# Altium project Servo-Board-v1.0.PrjPcb (part 15 of 19)

## Sheet DIO_3.SchDoc
size 420 x 297 mm; SheetNumber: 26; SheetTotal: 32
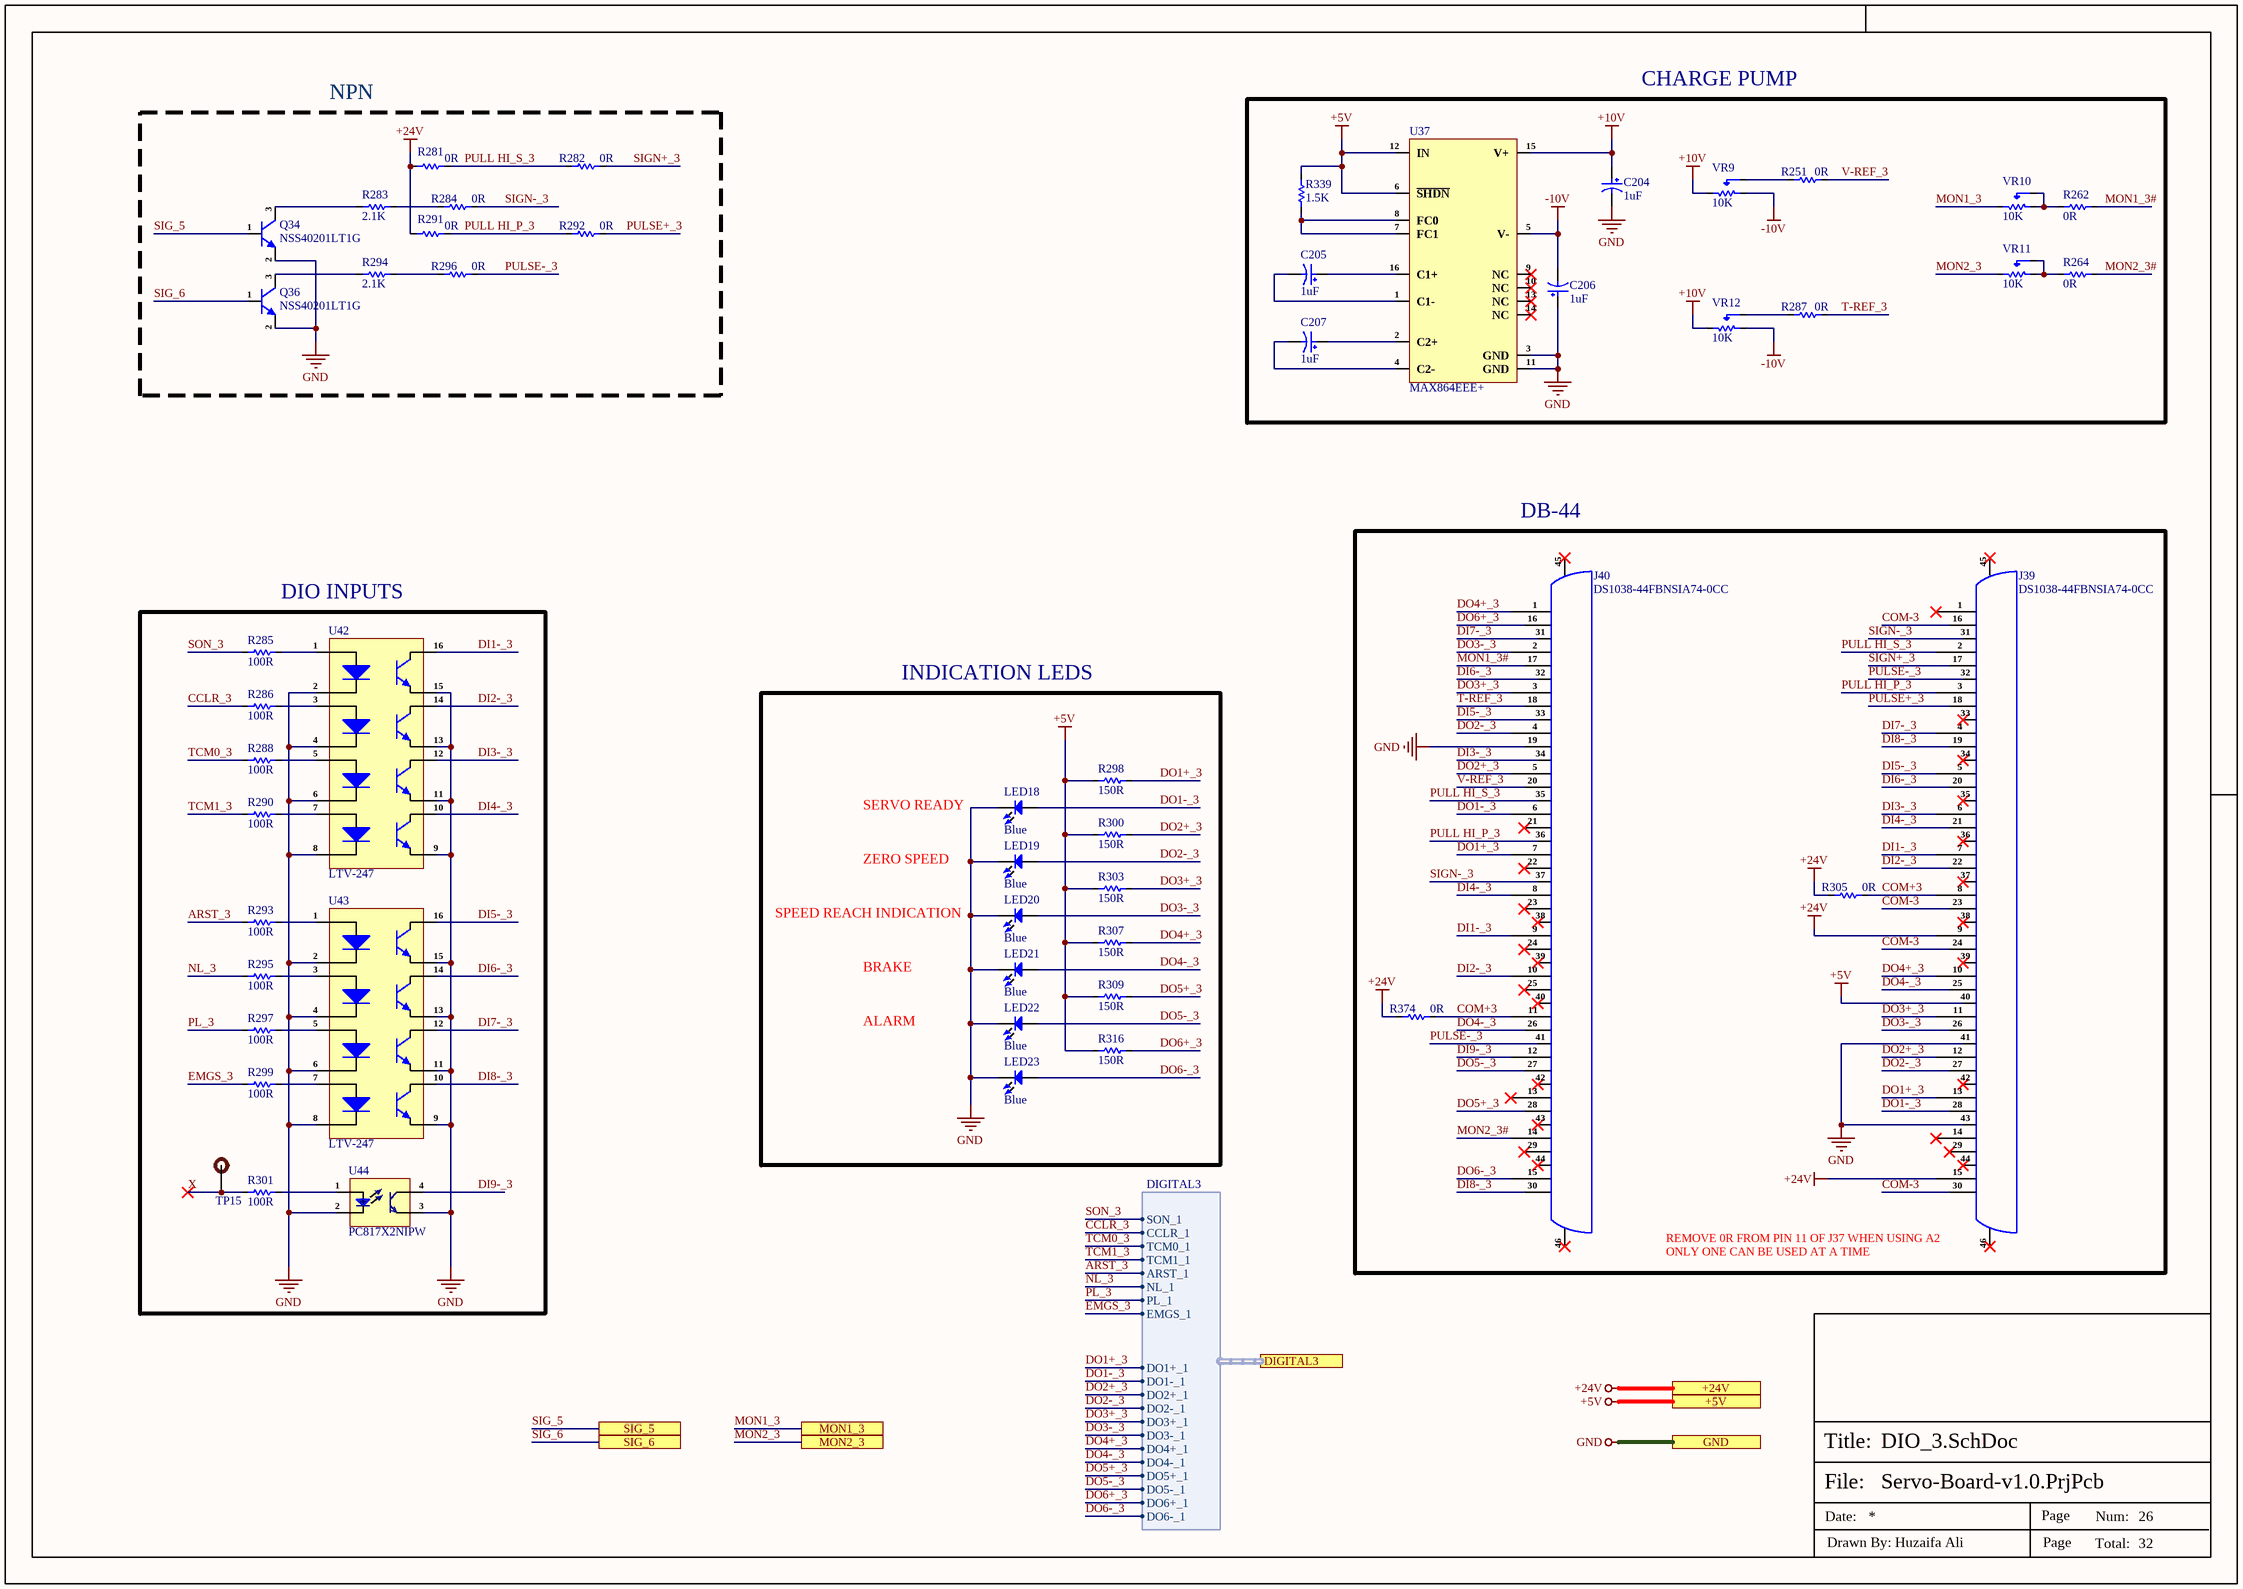
[diagram p25: DIO_3.SchDoc]

### Parts
C204  1uF  [RVT1H1R0M0405]
C205  1uF  [RVT1H1R0M0405]
C206  1uF  [RVT1H1R0M0405]
C207  1uF  [RVT1H1R0M0405]
J39  DS1038-44FBNSIA74-0CC  [DS1038-44FBNSIA74-0CC]
J40  DS1038-44FBNSIA74-0CC  [DS1038-44FBNSIA74-0CC]
LED18  Blue  [LED-0603]
LED19  Blue  [LED-0603]
LED20  Blue  [LED-0603]
LED21  Blue  [LED-0603]
LED22  Blue  [LED-0603]
LED23  Blue  [LED-0603]
Q34  NSS40201LT1G  [SOT-23]
Q36  NSS40201LT1G  [SOT-23]
R251  0R  [Res-0402]
R262  0R  [Res-0402]
R264  0R  [Res-0402]
R281  0R  [Res-0603]
R282  0R  [Res-0603]
R283  2.1K  [Res-0603]
R284  0R  [Res-0603]
R285  100R  [Res-0402]
R286  100R  [Res-0402]
R287  0R  [Res-0402]
R288  100R  [Res-0402]
R290  100R  [Res-0402]
R291  0R  [Res-0603]
R292  0R  [Res-0603]
R293  100R  [Res-0402]
R294  2.1K  [Res-0603]
R295  100R  [Res-0402]
R296  0R  [Res-0603]
R297  100R  [Res-0402]
R298  150R  [Res-0603]
R299  100R  [Res-0402]
R300  150R  [Res-0603]
R301  100R  [Res-0402]
R303  150R  [Res-0603]
R305  0R  [Res-0402]
R307  150R  [Res-0603]
R309  150R  [Res-0603]
R316  150R  [Res-0603]
R339  1.5K  [Res-0402]
R374  0R  [Res-0402]
TP15  TEST POINT  [Test-point]  (value not drawn)  (no BOM)
U37  MAX864EEE+  [16-QSOP]
U42  LTV-247  [16-SO]
U43  LTV-247  [16-SO]
U44  PC817X2NIPW  [PC817X2NIPW]
VR9  10K  [3362P-1-103]
VR10  10K  [3362P-1-103]
VR11  10K  [3362P-1-103]
VR12  10K  [3362P-1-103]

### Blocks framed on the sheet
NPN: Q34 Q36 R281-R284 R291 R292 R294 R296

### Ports
+5V (see Servo3[4C], CAN_Sheet[5D], DIO_1[5D], DIO_2[5D], DIO_4[5D], Encoder_Sheet1[5D], Encoder_Sheet2[5D], Encoder_Sheet3[5D], Encoder_Sheet4[5D], Power_Sheet[5D]), +24V (see Servo3[4C], Connector_Sheet[5D], DIO_1[5D], DIO_2[5D], DIO_4[5D], MOSFET_Driver_Sheet1[5D], MOSFET_Driver_Sheet2[5D], MOSFET_Driver_Sheet3[5D], MOSFET_Driver_Sheet4[5D], Motor_Driver_Sheet1[5D], Motor_Driver_Sheet2[5D], Motor_Driver_Sheet3[5D], Motor_Driver_Sheet4[5D], Power_Sheet[5D]), DIGITAL3 (harness DIGITAL3, see Servo3[4C], Sec_Controller_Sheet3[4D]), GND (see Servo3[4C], CAN_Sheet[5D], Connector_Sheet[5D], Controller_Sheet[5D], DIO_1[5D], DIO_2[5D], DIO_4[5D], Encoder_Sheet1[5D], Encoder_Sheet2[5D], Encoder_Sheet3[5D], Encoder_Sheet4[5D], EtherCAT_Sheet[5D], MOSFET_Driver_Sheet1[5D], MOSFET_Driver_Sheet2[5D], MOSFET_Driver_Sheet3[5D], MOSFET_Driver_Sheet4[5D], Motor_Driver_Sheet1[5D], Motor_Driver_Sheet2[5D], Motor_Driver_Sheet3[5D], Motor_Driver_Sheet4[5D], Power_Sheet[5D], RJ45_Sheet[5D], RS485_RS232_Sheet[3D], Sec_Controller_Sheet1[5D], Sec_Controller_Sheet2[5D], Sec_Controller_Sheet3[5D], Sec_Controller_Sheet4[5D]), MON1_3 (see Servo3[4C], Sec_Controller_Sheet3[3D]), MON2_3 (see Servo3[4C], Sec_Controller_Sheet3[3D]), SIG_5 (see Servo3[4C], Sec_Controller_Sheet3[3D]), SIG_6 (see Servo3[4C], Sec_Controller_Sheet3[3D])

### Harnesses
DIGITAL3: SON_1, TCM0_1, CCLR_1, TCM1_1, ARST_1, NL_1, PL_1, EMGS_1, DO1+_1, DO1-_1, DO2+_1, DO2-_1, DO3+_1, DO3-_1, DO4+_1, DO4-_1, DO5+_1, DO5-_1, DO6+_1, DO6-_1

### Nets
+5V: J39.40 R298.1 R300.1 R303.1 R307.1 R309.1 R316.1 R339.2 U37.6(~{SHDN}) U37.12(IN) ; port +5V
+10V: C204.1 U37.15(V+) VR9.3(CW) VR12.3(CW)
+24V: J39.9 J39.15 R281.1 R291.1 R305.1 R374.1 ; port +24V  [project net VDRAIN]
-10V: C206.2 U37.5(V-) VR9.1(CCW) VR12.1(CCW)
GND: C204.2 C206.1 J39.41 J39.43 J40.19 LED18.2 LED19.2 LED20.2 LED21.2 LED22.2 LED23.2 Q34.2(E) Q36.2(E) U37.3(GND) U37.11(GND) U42.2(K) U42.4(K) U42.6(K) U42.8(K) U42.9(E) U42.11(E) U42.13(E) U42.15(E) U43.2(K) U43.4(K) U43.6(K) U43.8(K) U43.9(E) U43.11(E) U43.13(E) U43.15(E) U44.2(Ca) U44.3(E) ; port GND
ARST_3: R293.1 ; port DIGITAL3.ARST_1
CCLR_3: R286.1 ; port DIGITAL3.CCLR_1
COM+3: J39.8 J40.11 R305.2 R374.2
COM-3: J39.16 J39.23 J39.24 J39.30
DI1-_3: J39.7 J40.9 U42.16(C)
DI2-_3: J39.22 J40.10 U42.14(C)
DI3-_3: J39.6 J40.34 U42.12(C)
DI4-_3: J39.21 J40.8 U42.10(C)
DI5-_3: J39.5 J40.33 U43.16(C)
DI6-_3: J39.20 J40.32 U43.14(C)
DI7-_3: J39.4 J40.31 U43.12(C)
DI8-_3: J39.19 J40.30 U43.10(C)
DI9-_3: J40.12 U44.4(C)
DO1+_3: J39.13 J40.7 R298.2 ; port DIGITAL3.DO1+_1
DO1-_3: J39.28 J40.6 LED18.1 ; port DIGITAL3.DO1-_1
DO2+_3: J39.12 J40.5 R300.2 ; port DIGITAL3.DO2+_1
DO2-_3: J39.27 J40.4 LED19.1 ; port DIGITAL3.DO2-_1
DO3+_3: J39.11 J40.3 R303.2 ; port DIGITAL3.DO3+_1
DO3-_3: J39.26 J40.2 LED20.1 ; port DIGITAL3.DO3-_1
DO4+_3: J39.10 J40.1 R307.2 ; port DIGITAL3.DO4+_1
DO4-_3: J39.25 J40.26 LED21.1 ; port DIGITAL3.DO4-_1
DO5+_3: J40.28 R309.2 ; port DIGITAL3.DO5+_1
DO5-_3: J40.27 LED22.1 ; port DIGITAL3.DO5-_1
DO6+_3: J40.16 R316.2 ; port DIGITAL3.DO6+_1
DO6-_3: J40.15 LED23.1 ; port DIGITAL3.DO6-_1
EMGS_3: R299.1 ; port DIGITAL3.EMGS_1
MON1_3: VR10.3(CW) ; port MON1_3
MON1_3#: J40.17 R262.2
MON2_3: VR11.3(CW) ; port MON2_3
MON2_3#: J40.14 R264.2
NL_3: R295.1 ; port DIGITAL3.NL_1
PL_3: R297.1 ; port DIGITAL3.PL_1
PULL HI_P_3: J39.3 J40.36 R291.2 R292.1
PULL HI_S_3: J39.2 J40.35 R281.2 R282.1
PULSE+_3: J39.18 R292.2
PULSE-_3: J39.32 J40.41 R296.2
SIG_5: Q34.1(B) ; port SIG_5
SIG_6: Q36.1(B) ; port SIG_6
SIGN+_3: J39.17 R282.2
SIGN-_3: J39.31 J40.37 R284.2
SON_3: R285.1 ; port DIGITAL3.SON_1
T-REF_3: J40.18 R287.2
TCM0_3: R288.1 ; port DIGITAL3.TCM0_1
TCM1_3: R290.1 ; port DIGITAL3.TCM1_1
V-REF_3: J40.20 R251.2
X: R301.1 TP15.1
NetC205_1: C205.1 U37.16(C1+)
NetC205_2: C205.2 U37.1(C1-)
NetC207_1: C207.1 U37.2(C2+)
NetC207_2: C207.2 U37.4(C2-)
NetQ34_3: Q34.3(C) R283.1
NetQ36_3: Q36.3(C) R294.1
NetR251_1: R251.1 VR9.2(Wiper)
NetR262_1: R262.1 VR10.1(CCW) VR10.2(Wiper)
NetR264_1: R264.1 VR11.1(CCW) VR11.2(Wiper)
NetR283_2: R283.2 R284.1
NetR285_2: R285.2 U42.1(A)
NetR286_2: R286.2 U42.3(A)
NetR287_1: R287.1 VR12.2(Wiper)
NetR288_2: R288.2 U42.5(A)
NetR290_2: R290.2 U42.7(A)
NetR293_2: R293.2 U43.1(A)
NetR294_2: R294.2 R296.1
NetR295_2: R295.2 U43.3(A)
NetR297_2: R297.2 U43.5(A)
NetR299_2: R299.2 U43.7(A)
NetR301_2: R301.2 U44.1(An)
NetR339_1: R339.1 U37.7(FC1) U37.8(FC0)

Not connected (* = marked no-connect by the designer): J39 1* 14* 29* 33* 34* 35* 36* 37* 38* 39* 42* 44* 45* 46*; J40 13* 21* 22* 23* 24* 25* 29* 38* 39* 40* 42* 43* 44* 45* 46*; U37 9(NC)* 10(NC)* 13(NC)* 14(NC)*

### Notes on the sheet
- CHARGE PUMP
- (near J40) DB-44
- DIO INPUTS
- INDICATION LEDS
- SERVO READY
- ZERO SPEED
- SPEED REACH INDICATION
- BRAKE
- ALARM
- REMOVE 0R FROM PIN 11 OF J37 WHEN USING A2
- ONLY ONE CAN BE USED AT A TIME
- File:
- Title:
- Date:
- Page
- Num:
- Total:
- Drawn By: Huzaifa Ali

### Library data of the parts
C204-C207 = RVT1H1R0M0405: 1uF 50V 8mA@120Hz ±20% SMD,D4xL5.4mm Aluminum Electrolytic Capacitors - SMD ROHS; Manufacturer: Roqang; Supplier: LCSC; LCSC Part Number: C72491; Manufacturer Part Number: RVT1H1R0M0405; RoHS: No
J39 J40 = DS1038-44FBNSIA74-0CC: 44P Female D-Sub Right-Angle 3 1.5A -40℃~+105℃ Push-Pull D-Sub / VGA connector ROHS; Manufacturer: CONNFLY Elec; Manufacturer Part Number: DS1038-44FBNSIA74-0CC; Package: Push-Pull; LCSC Part Number: C77844; Item Type: D-Sub / VGA connector; ComponentLink1Description: LCSC; ComponentLink1URL: https://www.lcsc.com/product-detail/D-Sub-VGA-connector_CONNFLY-Elec-DS1038-44FBNSIA74-0CC_C77844.html
LED18-LED23 = NCD0603B3: blue 0603 Light Emitting Diodes (LED) ROHS; Manufacturer: Foshan NationStar Optoelectronics; Manufacturer Part Number: NCD0603B3; Package: 0603; LCSC Part Number: C158101; Item Type: LED; ComponentLink1Description: LCSC; ComponentLink1URL: https://www.lcsc.com/product-detail/Light-Emitting-Diodes-LED_Foshan-NationStar-Optoelectronics-NCD0603B3_C158101.html
Q34 Q36 = NSS40201LT1G: TRANS NPN 40V 2A SOT23-3; Manufacturer: ON Semiconductor; Max Power Dissipation: 540mW; Transition Frequency: 150MHz; hFE Min: 200; Number of Elements: 1; Emitter Base Voltage (VEBO): 6V; Collector Emitter Saturation Voltage: 115mV; Element Configuration: Single; Clock Frequency: 100MHz; Item Type: Transistor; Supplier 1: Future Electronics; Manufacturer Part Number: NSS40201LT1G; RoHS: Yes; Category: BJTs; Stock 1: 155; Pricing 1: 1=0.42000, 15=0.34000, 75=0.29500, 300=0.25500, 1500=0.21000 (USD); Case/Package: SOT-23-3; Pins: 3; Min Operating Temperature: -55°C; Max Operating Temperature: 150°C; Collector Emitter Voltage (VCEO): 40V; Packaging: Tape and Reel; Max Collector Current: 2A; Collector Emitter Breakdown Voltage: 40V; Polarity: NPN; Package Quantity: 3000; Frequency: 150MHz; Max Breakdown Voltage: 40V; Collector Base Voltage (VCBO): 40V; Power Dissipation: 540mW; Gain Bandwidth Product: 150MHz; Series: -; Collector-emitter Voltage-Max: 115mV; Length: 3.04mm; Width: 2.64mm; Height: 1.11mm; Radiation Hardening: No; Lead Free: Lead Free; Reach SVHC Compliant: Yes; Halogen Free: Halogen Free; RoHS Compliant: Yes; ComponentLink1URL: https://datasheet.ciiva.com/976/nss40201l-d-976800.pdf?src-supplier=Digi-Key; ComponentLink1Description: https://datasheet.ciiva.com/976/nss40201l-d-976800.pdf?src-supplier=Digi-Key; ComponentLink2URL: https://datasheet.ciiva.com/11204/nss40201l-d-11204882.pdf?src-supplier=Avnet; ComponentLink2Description: https://datasheet.ciiva.com/11204/nss40201l-d-11204882.pdf?src-supplier=Avnet; ComponentLink3URL: https://datasheet.ciiva.com/16291/nss40201l-d-115376-16291797.pdf?src-supplier=Mouser; ComponentLink3Description: https://datasheet.ciiva.com/16291/nss40201l-d-115376-16291797.pdf?src-supplier=Mouser; ComponentLink4URL: https://datasheet.ciiva.com/30480/0900766b8121b5a5-30480502.pdf?src-supplier=Rs; ComponentLink4Description: https://datasheet.ciiva.com/30480/0900766b8121b5a5-30480502.pdf?src-supplier=Rs; ComponentLink5URL: https://datasheet.ciiva.com/976/nss40201l-d-976801.pdf?src-supplier=Digi-Key; ComponentLink5Description: https://datasheet.ciiva.com/976/nss40201l-d-976801.pdf?src-supplier=Digi-Key; ComponentLink6URL: https://datasheet.ciiva.com/976/nss40201l-d-976802.pdf?src-supplier=Digi-Key; ComponentLink6Description: https://datasheet.ciiva.com/976/nss40201l-d-976802.pdf?src-supplier=Digi-Key; ComponentLink7URL: https://datasheet.ciiva.com/22641/nss40201l-d-22641179.pdf?src-supplier=Farnell; ComponentLink7Description: https://datasheet.ciiva.com/22641/nss40201l-d-22641179.pdf?src-supplier=Farnell; ComponentLink8URL: https://datasheet.ciiva.com/16222/nss40201l-d-16222093.pdf?src-supplier=Future+Electronics; ComponentLink8Description: https://datasheet.ciiva.com/16222/nss40201l-d-16222093.pdf?src-supplier=Future+Electronics; Supplier Part Number 1: 6030674; LCSC Part Number: C145175
R251 R262 R264 R287 R305 R374 = RC0402FR-070RL: as R60 on sheet Sec_Controller_Sheet3; Supplier 1: Mouser; Manufacturer Part Number: RC0402FR-070RL; RoHS: Yes; Stock 1: 8556842; Pricing 1: 1=0.10000, 10=0.01400, 50=0.01400, 100=0.00600, 1000=0.00300, 5000=0.00200, 10000=0.00100 (USD); Mount: Surface Mount; Case/Package: 0402; Contact Plating: Tin,Matte; Case Code (Imperial): 0402; Case Code (Metric): 1005; Size Code: 0402; Min Operating Temperature: -55°C; Max Operating Temperature: 155°C; Resistance: 0R; Resistor Type: Thick Film; Packaging: Tape and Reel; Termination: SMD/SMT; Features: Moisture Resistant; Series: RC; Number of Terminations: 2; Length: 1mm; Width: 0.5mm; Height: 0.35mm; Radiation Hardening: No; Lead Free: Lead Free; RoHS Compliant: Yes; ComponentLink1URL: https://datasheet.ciiva.com/8896/pyu-rc0402-51-rohs-l-6-8896149.pdf?src-supplier=Avnet; ComponentLink1Description: https://datasheet.ciiva.com/8896/pyu-rc0402-51-rohs-l-6-8896149.pdf?src-supplier=Avnet; ComponentLink2URL: https://datasheet.ciiva.com/16790/pyu-rc0402-51-rohs-l-6-r-16790444.pdf?src-supplier=Future+Electronics; ComponentLink2Description: https://datasheet.ciiva.com/16790/pyu-rc0402-51-rohs-l-6-r-16790444.pdf?src-supplier=Future+Electronics; Supplier Part Number 1: 603-RC0402FR-070RL; LCSC Part Number: C106231
R281 R282 R284 R291 R292 R296 = RC0603JR-070RL: as R61-R63 on sheet Sec_Controller_Sheet3; Supplier 1: Digi-Key; Manufacturer Part Number: RC0603JR-070RL; RoHS: Yes; Category: Chip SMD Resistors; Stock 1: 18081776; Pricing 1: 1=0.10000, 10=0.01700, 25=0.01240, 50=0.00960, 100=0.00700, 250=0.00536, 500=0.00430, 1000=0.00316 (USD); Case/Package: 0603; Number of Pins: 2; Contact Plating: Tin,Matte; Case Code (Imperial): 0603; Case Code (Metric): 1608; Size Code: 0603; Min Operating Temperature: -55°C; Max Operating Temperature: 155°C; Resistor Type: Thick Film; Packaging: Tape and Reel; Termination: SMD/SMT; Series: RC; Technology: THICK FILM; Package Quantity: 5000; Voltage Rating: 50V; Features: Moisture Resistant; Max Power Dissipation: 100mW; Number of Terminations: 2; Construction: Rectangular; Length: 1.6mm; Width: 0.8mm; Height: 0.45mm; Depth: 0.8mm; Radiation Hardening: No; Reach SVHC Compliant: No SVHC; Lead Free: Lead Free; RoHS Compliant: Yes; Military Standard: Not; Supplier Part Number 1: 311-0.0GRCT-ND; LCSC Part Number: C95177
R283 R294 = RT0603BRD072K1L: RES SMD 2.1K OHM 0.1% 1/10W 0603; Manufacturer: Yageo; Resistance: 2.1kR; Voltage Rating: 75V; Power Rating: 100mW; Temperature Coefficient: 25ppm/°C; Voltage Rating (DC): 50V; Item Type: Resistor; Supplier 1: Arrow Electronics; Manufacturer Part Number: RT0603BRD072K1L; RoHS: Yes; Category: Chip SMD Resistors; Stock 1: 4891; Pricing 1: 1=0.32000, 10=0.26320, 25=0.26040, 100=0.10310, 250=0.10280, 500=0.10180, 1000=0.06110, 3000=0.03900 (USD); Case/Package: 0603; Case Code (Imperial): 0603; Case Code (Metric): 1608; Min Operating Temperature: -55°C; Max Operating Temperature: 125°C; Tolerance: 0.1%; Packaging: Tape and Reel; Resistor Type: Thin Film; Number of Terminations: 2; Termination: SMD/SMT; Max Power Dissipation: 100mW; Features: Moisture Resistant; Series: RT; Construction: Rectangular; Length: 0.063inch; Width: 0.031inch; Height: 0.022inch; Depth: 0.8mm; Military Standard: Not; Lead Free: Lead Free; RoHS Compliant: Yes; ComponentLink1URL: https://datasheet.ciiva.com/12723/pyu-rt-1-to-0-05-rohs-l-4-12723880.pdf?src-supplier=Mouser; ComponentLink1Description: https://datasheet.ciiva.com/12723/pyu-rt-1-to-0-05-rohs-l-4-12723880.pdf?src-supplier=Mouser; Supplier Part Number 1: RT0603BRD072K1L; LCSC Part Number: C861293
R285 R286 R288 R290 R293 R295 R297 R299 R301 = RC0402FR-07100RL: RES 100 OHM 1% 1/16W 0402; Manufacturer: Yageo; Power Rating: 62.5mW; Voltage Rating: 50V; Temperature Coefficient: 100ppm/°C; Max Power Dissipation: 63mW; Item Type: Resistor; Supplier 1: Mouser; Manufacturer Part Number: RC0402FR-07100RL; RoHS: Yes; Category: Chip SMD Resistors; Stock 1: 699545; Pricing 1: 1=0.10000, 10=0.01200, 50=0.01200, 100=0.00500, 1000=0.00300, 2500=0.00200, 10000=0.00100 (USD); Case/Package: 0402; Number of Pins: 2; Case Code (Imperial): 0402; Case Code (Metric): 1005; Size Code: 0402; Min Operating Temperature: -55°C; Max Operating Temperature: 155°C; Tolerance: 1%; Voltage Rating (DC): 50V; Resistance: 100R; Packaging: Tape and Reel; Termination: SMD/SMT; Resistor Type: Thick Film; Features: Moisture Resistant; Series: RC; Number of Terminations: 2; Resistance Tolerance: 1%; Construction: Rectangular; Technology: THICK FILM; Length: 1mm; Width: 0.5mm; Height: 0.32mm; Depth: 0.5mm; RoHS Compliant: Yes; REACH SVHC: No SVHC; Military Standard: Not; Lead Free: Lead Free; ComponentLink1URL: https://datasheet.ciiva.com/11808/0900766b80c66297-11808765.pdf?src-supplier=RSComponents; ComponentLink1Description: https://datasheet.ciiva.com/11808/0900766b80c66297-11808765.pdf?src-supplier=RSComponents; ComponentLink2URL: https://datasheet.ciiva.com/7849/1784430-7849810.pdf?src-supplier=Element14; ComponentLink2Description: https://datasheet.ciiva.com/7849/1784430-7849810.pdf?src-supplier=Element14; ComponentLink3URL: https://datasheet.ciiva.com/28367/1018594-28367226.pdf?src-supplier=Element14; ComponentLink3Description: https://datasheet.ciiva.com/28367/1018594-28367226.pdf?src-supplier=Element14; ComponentLink4URL: https://datasheet.ciiva.com/22747/1018594-22747511.pdf?src-supplier=Element14; ComponentLink4Description: https://datasheet.ciiva.com/22747/1018594-22747511.pdf?src-supplier=Element14; ComponentLink5URL: https://datasheet.ciiva.com/12667/pyu-rc0402-51-rohs-l-6-r-12667957.pdf?src-supplier=Mouser; ComponentLink5Description: https://datasheet.ciiva.com/12667/pyu-rc0402-51-rohs-l-6-r-12667957.pdf?src-supplier=Mouser; ComponentLink6URL: https://datasheet.ciiva.com/15189/getdatasheetpartid-329466-15189335.pdf?src-supplier=Verical; ComponentLink6Description: https://datasheet.ciiva.com/15189/getdatasheetpartid-329466-15189335.pdf?src-supplier=Verical; ComponentLink7URL: https://datasheet.ciiva.com/16740/pyu-rc0402-51-rohs-l-6-r-16740566.pdf?src-supplier=Future+Electronics; ComponentLink7Description: https://datasheet.ciiva.com/16740/pyu-rc0402-51-rohs-l-6-r-16740566.pdf?src-supplier=Future+Electronics; Supplier Part Number 1: 603-RC0402FR-07100RL; LCSC Part Number: C106232
R298 R300 R303 R307 R309 R316 = RC0603DR-07150RL: RES 150 OHM 0.5% 1/10W 0603; Manufacturer: Yageo; Max Power Dissipation: 100mW; Temperature Coefficient: 100ppm/°C; Item Type: Resistor; Supplier 1: Avnet; Manufacturer Part Number: RC0603DR-07150RL; RoHS: Yes; Category: Chip SMD Resistors; Pricing 1: 5000=0.00430, 10000=0.00424, 20000=0.00411 (USD); Case/Package: 0603; Min Operating Temperature: -55°C; Max Operating Temperature: 155°C; Packaging: Tape and Reel; Resistance: 150R; Resistor Type: Thick Film; Number of Terminations: 2; Tolerance: 0.5%; Features: Moisture Resistant; Length: 0.063inch; Width: 0.031inch; Height: 0.022inch; RoHS Compliant: Yes; ComponentLink1URL: http://www.yageo.com.tw/exep/pages/download/literatures/PYu-R_INT-thick_7.pdf?src-supplier=Digi-Key; ComponentLink1Description: http://www.yageo.com.tw/exep/pages/download/literatures/PYu-R_INT-thick_7.pdf?src-supplier=Digi-Key; Supplier Part Number 1: RC0603DR-07150RL; LCSC Part Number: C471801
R339 = RC0402FR-071K5L: RES 1.5K OHM 1% 1/16W 0402; Manufacturer: Yageo; Resistance: 1.5kR; Power Rating: 62.5mW; Voltage Rating: 50V; Temperature Coefficient: 100ppm/°C; Max Power Dissipation: 63mW; Supplier 1: Digi-Key; Manufacturer Part Number: RC0402FR-071K5L; RoHS: Yes; Category: Chip SMD Resistors; Stock 1: 2832947; Pricing 1: 1=0.10000, 10=0.01500, 100=0.00610, 1000=0.00275, 2500=0.00239, 5000=0.00197 (USD); Case/Package: 0402; Case Code (Metric): 1005; Case Code (Imperial): 0402; Size Code: 0402; Min Operating Temperature: -55°C; Max Operating Temperature: 155°C; Resistor Type: Thick Film; Package Quantity: 1; Tolerance: 1%; Packaging: Tape and Reel; Number of Terminations: 2; Termination: SMD/SMT; Features: Moisture Resistant; Series: RC; Resistance Tolerance: 1%; Construction: Rectangular; Technology: THICK FILM; Length: 1mm; Width: 0.02inch; Height: 0.016inch; Depth: 0.5mm; RoHS Compliant: Yes; REACH SVHC: No SVHC; Military Standard: Not; Lead Free: Lead Free; ComponentLink1URL: https://datasheet.ciiva.com/11808/0900766b80c66297-11808238.pdf?src-supplier=RSComponents; ComponentLink1Description: https://datasheet.ciiva.com/11808/0900766b80c66297-11808238.pdf?src-supplier=RSComponents; ComponentLink2URL: https://datasheet.ciiva.com/46394/1018594-46394950.pdf?src-supplier=Element14; ComponentLink2Description: https://datasheet.ciiva.com/46394/1018594-46394950.pdf?src-supplier=Element14; ComponentLink3URL: https://datasheet.ciiva.com/2453/pyu-r-int-thick-7-2453440.pdf?src-supplier=Digi-Key; ComponentLink3Description: https://datasheet.ciiva.com/2453/pyu-r-int-thick-7-2453440.pdf?src-supplier=Digi-Key; ComponentLink4URL: https://datasheet.ciiva.com/2453/pyu-r-int-thick-7-2453441.pdf?src-supplier=Digi-Key; ComponentLink4Description: https://datasheet.ciiva.com/2453/pyu-r-int-thick-7-2453441.pdf?src-supplier=Digi-Key; ComponentLink5URL: https://datasheet.ciiva.com/2453/pyu-r-int-thick-7-2453439.pdf?src-supplier=Digi-Key; ComponentLink5Description: https://datasheet.ciiva.com/2453/pyu-r-int-thick-7-2453439.pdf?src-supplier=Digi-Key; ComponentLink6URL: https://datasheet.ciiva.com/12558/pyu-rc0402-51-rohs-l-6-r-8721-12558542.pdf?src-supplier=Mouser; ComponentLink6Description: https://datasheet.ciiva.com/12558/pyu-rc0402-51-rohs-l-6-r-8721-12558542.pdf?src-supplier=Mouser; ComponentLink7URL: https://datasheet.ciiva.com/7849/1018594-7849863.pdf?src-supplier=Element14; ComponentLink7Description: https://datasheet.ciiva.com/7849/1018594-7849863.pdf?src-supplier=Element14; ComponentLink8URL: https://datasheet.ciiva.com/7849/1018594-7849864.pdf?src-supplier=Element14; ComponentLink8Description: https://datasheet.ciiva.com/7849/1018594-7849864.pdf?src-supplier=Element14; ComponentLink9URL: https://datasheet.ciiva.com/15189/getdatasheetpartid-323992-15189370.pdf?src-supplier=Verical; ComponentLink9Description: https://datasheet.ciiva.com/15189/getdatasheetpartid-323992-15189370.pdf?src-supplier=Verical; Supplier Part Number 1: 311-1.50KLRCT-ND; LCSC Part Number: C114759
TP15 = TEST POINT: Test Point ON; Item Type: TEST POINT
U37 = MAX864EEE+: IC REG CHARGE PUMP INV 16QSOP; Manufacturer: Maxim; Output Current: 20mA; Output Voltage: 12V; Logic Function: Inverting; Number of Outputs: 2; Switching Frequency: 185kHz; Synchronous Rectifier: No; Topology: Boost; Output Type: Adjustable; Max Supply Voltage: 6V; Min Supply Voltage: 1.75V; Operating Supply Current: 7mA; Min Output Voltage: 3.5V; Supplier: Digikey; Supplier Part Number: MAX864EEE+-ND; Manufacturer Part Number: MAX864EEE+; RoHS: Yes; Item Type: IC; Stock: 443; Pricing: 1=4.9, 10=4.399, 25=4.1588, 100=3.6042, 300=3.41937, 500=3.06818, 1000=2.58762, 2500=2.45824 (USD); Mounting Technology: Surface Mount; Case/Package: QSOP; Pins: 16; Weight: 0.010159oz; Min Operating Temperature: -40°C; Max Operating Temperature: 85°C; Packaging: Rail/Tube; Package Quantity: 100; Series: -; Min Input Voltage: 1.75V; Max Output Voltage: 12V; Termination: SMD/SMT; Length: 4.98mm; Width: 3.99mm; Height: 1.55mm; Radiation Hardening: No; Lead Free: Lead Free; RoHS Compliant: Yes; Reach SVHC Compliant: No; ComponentLink1URL: https://datasheet.ciiva.com/3215/max864-3215728.pdf?src-supplier=Avnet; ComponentLink1Description: https://datasheet.ciiva.com/3215/max864-3215728.pdf?src-supplier=Avnet; ComponentLink2URL: https://datasheet.ciiva.com/3216/max864-3216791.pdf?src-supplier=Avnet; ComponentLink2Description: https://datasheet.ciiva.com/3216/max864-3216791.pdf?src-supplier=Avnet; ComponentLink3URL: https://datasheet.ciiva.com/4874/max864-4874972.pdf?src-supplier=Mouser; ComponentLink3Description: https://datasheet.ciiva.com/4874/max864-4874972.pdf?src-supplier=Mouser; ComponentLink4URL: https://datasheet.ciiva.com/7994/9917-7994860.pdf?src-supplier=Element14; ComponentLink4Description: https://datasheet.ciiva.com/7994/9917-7994860.pdf?src-supplier=Element14
U42 U43 = LTV-247: OPTOISO 3.75KV 4CH TRANS 16SO; Manufacturer: Vishay Lite-On; Number of Channels: 4; Collector Emitter Voltage (VCEO): 80V; Reverse Breakdown Voltage: 6V; Forward Voltage: 1.2V; Forward Current: 20mA; Max Power Dissipation: 200mW; Output Current per Channel: 50mA; Collector Emitter Saturation Voltage: 400mV; Power Dissipation: 170mW; Current Transfer Ratio: 600%; Item Type: PhotoTransistor; Supplier 1: Future Electronics; Manufacturer Part Number: LTV-247; RoHS: Yes; Category: Optocouplers; Stock 1: 178000; Pricing 1: 2000=0.77000 (USD); Mount: Surface Mount; Case/Package: SMD/SMT; Number of Pins: 16; Min Operating Temperature: -55°C; Max Operating Temperature: 110°C; Package Quantity: 2000; Packaging: Tape and Reel; Max Output Voltage: 80V; Max Collector Current: 50mA; Number of Elements: 4; Max Input Current: 50mA; Radiation Hardening: No; RoHS Compliant: Yes; ComponentLink1URL: https://datasheet.ciiva.com/24015/ltv-247-256860-24015561.pdf?src-supplier=Mouser; ComponentLink1Description: https://datasheet.ciiva.com/24015/ltv-247-256860-24015561.pdf?src-supplier=Mouser; ComponentLink2URL: https://datasheet.ciiva.com/29730/ltv-214-244-29730320.pdf?src-supplier=Digi-Key; ComponentLink2Description: https://datasheet.ciiva.com/29730/ltv-214-244-29730320.pdf?src-supplier=Digi-Key; Supplier Part Number 1: 3051235; LCSC Part Number: C115451; ComponentLink3Description: LCSC; ComponentLink3URL: https://www.lcsc.com/product-detail/Optocouplers-Phototransistor-Output_Lite-On-LTV-247_C115451.html
U44 = PC817X2NIPW: Optoisolator Output Channel 4-SMD; Manufacturer: Sharp; Item Type: IC; Supplier: Mouser; Supplier Part Number: 852-PC817X2NIPW; Manufacturer Part Number: PC817X2NIPW; RoHS: No; Pricing: 1=0.54, 10=0.352, 50=0.352, 100=0.233, 1000=0.185, 10000=0.146 (USD); LCSC Part Number: C2840443
VR9-VR12 = 3362P-1-103: TRIMMER 10K OHM 0.5W PC PIN TOP; Manufacturer: Bourns; Item Type: Potentiometer; Supplier: Mouser; LCSC Part Number: C118956; Manufacturer Part Number: 3362P-1-103; RoHS: No; Stock: 1436; Pricing: 1=1.97, 10=1.44, 50=1.44, 100=1.13, 1000=0.756, 10000=0.756 (USD); ComponentLink1URL: https://datasheet.ciiva.com/19466/1931499-19466806.pdf?src-supplier=Jameco; ComponentLink1Description: https://datasheet.ciiva.com/19466/1931499-19466806.pdf?src-supplier=Jameco; ComponentLink2URL: https://datasheet.ciiva.com/3266/3362-3266710.pdf?src-supplier=Avnet; ComponentLink2Description: https://datasheet.ciiva.com/3266/3362-3266710.pdf?src-supplier=Avnet; ComponentLink3URL: https://datasheet.ciiva.com/2161/3362-2161230.pdf?src-supplier=Digikey; ComponentLink3Description: https://datasheet.ciiva.com/2161/3362-2161230.pdf?src-supplier=Digikey

## Sheet Servo4.SchDoc
size 420 x 297 mm; SheetNumber: 27; SheetTotal: 32
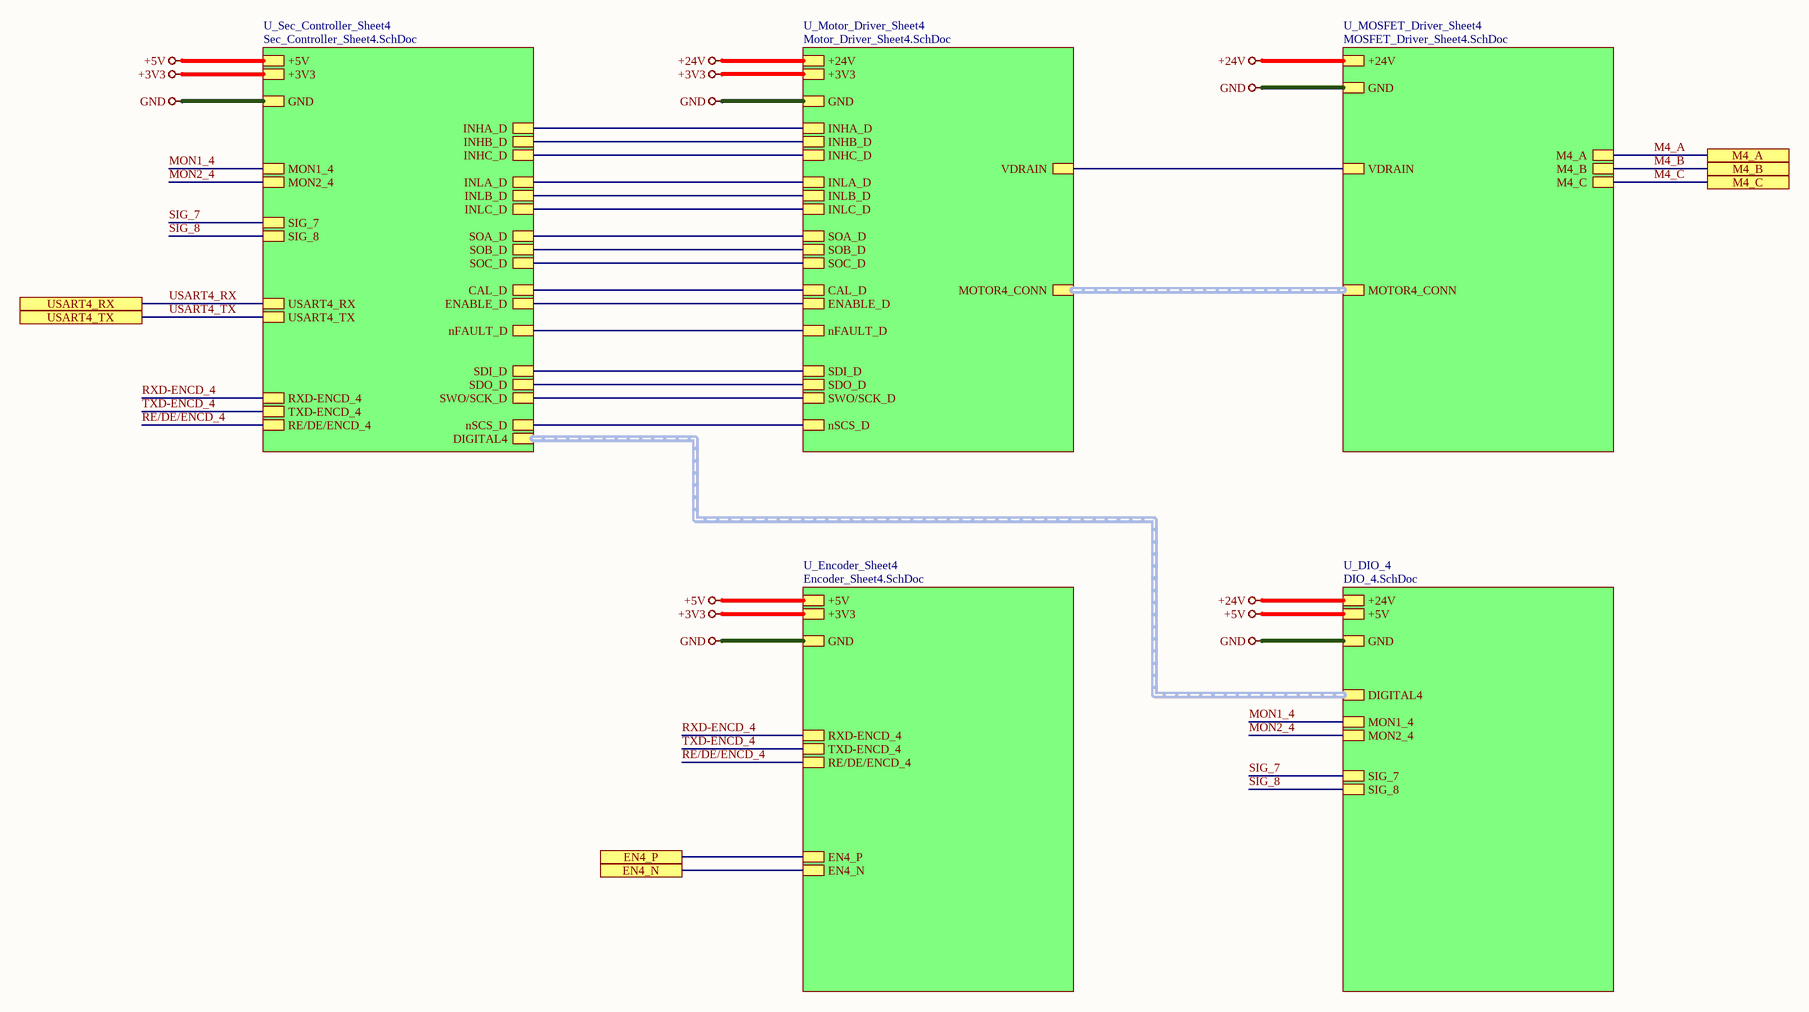
[diagram p26: Servo4.SchDoc]

### Sub-sheets
U_DIO_4 = DIO_4.SchDoc: +24V, +5V, GND, MON1_4, MON2_4, SIG_7, SIG_8, DIGITAL4 (harness DIGITAL1)
U_Encoder_Sheet4 = Encoder_Sheet4.SchDoc: +3V3, +5V, GND, EN4_N, EN4_P, RXD-ENCD_4, TXD-ENCD_4, RE/DE/ENCD_4
U_MOSFET_Driver_Sheet4 = MOSFET_Driver_Sheet4.SchDoc: +24V, GND, MOTOR4_CONN (harness MOTOR4_CONN), M4_A, M4_B, M4_C, VDRAIN
U_Motor_Driver_Sheet4 = Motor_Driver_Sheet4.SchDoc: +24V, +3V3, GND, MOTOR4_CONN (harness MOTOR4_CONN), INHA_D, INHB_D, INHC_D, INLA_D, INLB_D, INLC_D, nSCS_D, SDI_D, SDO_D, SWO/SCK_D, SOC_D, SOB_D, SOA_D, CAL_D, ENABLE_D, VDRAIN, nFAULT_D
U_Sec_Controller_Sheet4 = Sec_Controller_Sheet4.SchDoc: +3V3, GND, INHA_D, INHB_D, INHC_D, INLA_D, INLB_D, INLC_D, nSCS_D, SDI_D, SDO_D, SWO/SCK_D, SOC_D, SOB_D, SOA_D, CAL_D, ENABLE_D, nFAULT_D, USART4_RX, USART4_TX, RXD-ENCD_4, TXD-ENCD_4, RE/DE/ENCD_4, MON1_4, MON2_4, SIG_7, SIG_8, DIGITAL4 (harness DIGITAL1), +5V

### Ports
EN4_N (see Top_Sheet[6B], Connector_Sheet[3D], Encoder_Sheet4[2D]), EN4_P (see Top_Sheet[6B], Connector_Sheet[3D], Encoder_Sheet4[2D]), M4_A (see Top_Sheet[6C], Connector_Sheet[4D], MOSFET_Driver_Sheet4[3D]), M4_B (see Top_Sheet[6C], Connector_Sheet[4D], MOSFET_Driver_Sheet4[3D]), M4_C (see Top_Sheet[6C], Connector_Sheet[4D], MOSFET_Driver_Sheet4[3D]), USART4_RX (see Top_Sheet[6B], Controller_Sheet[2D], Sec_Controller_Sheet4[1D]), USART4_TX (see Top_Sheet[6B], Controller_Sheet[2D], Sec_Controller_Sheet4[1D])

### Nets
+3V3: sheet U_Motor_Driver_Sheet4/+3V3, sheet U_Sec_Controller_Sheet4/+3V3, sheet U_Encoder_Sheet4/+3V3
+5V: sheet U_Sec_Controller_Sheet4/+5V, sheet U_Encoder_Sheet4/+5V, sheet U_DIO_4/+5V
+24V: sheet U_MOSFET_Driver_Sheet4/+24V, sheet U_MOSFET_Driver_Sheet4/VDRAIN, sheet U_Motor_Driver_Sheet4/+24V, sheet U_Motor_Driver_Sheet4/VDRAIN, sheet U_DIO_4/+24V  [project net VDRAIN]
GND: sheet U_MOSFET_Driver_Sheet4/GND, sheet U_Motor_Driver_Sheet4/GND, sheet U_Sec_Controller_Sheet4/GND, sheet U_Encoder_Sheet4/GND, sheet U_DIO_4/GND
CAL_D: sheet U_Motor_Driver_Sheet4/CAL_D, sheet U_Sec_Controller_Sheet4/CAL_D
EN4_N: port EN4_N, sheet U_Encoder_Sheet4/EN4_N
EN4_P: port EN4_P, sheet U_Encoder_Sheet4/EN4_P
ENABLE_D: sheet U_Motor_Driver_Sheet4/ENABLE_D, sheet U_Sec_Controller_Sheet4/ENABLE_D
INHA_D: sheet U_Motor_Driver_Sheet4/INHA_D, sheet U_Sec_Controller_Sheet4/INHA_D
INHB_D: sheet U_Motor_Driver_Sheet4/INHB_D, sheet U_Sec_Controller_Sheet4/INHB_D
INHC_D: sheet U_Motor_Driver_Sheet4/INHC_D, sheet U_Sec_Controller_Sheet4/INHC_D
INLA_D: sheet U_Motor_Driver_Sheet4/INLA_D, sheet U_Sec_Controller_Sheet4/INLA_D
INLB_D: sheet U_Motor_Driver_Sheet4/INLB_D, sheet U_Sec_Controller_Sheet4/INLB_D
INLC_D: sheet U_Motor_Driver_Sheet4/INLC_D, sheet U_Sec_Controller_Sheet4/INLC_D
M4_A: port M4_A, sheet U_MOSFET_Driver_Sheet4/M4_A
M4_B: port M4_B, sheet U_MOSFET_Driver_Sheet4/M4_B
M4_C: port M4_C, sheet U_MOSFET_Driver_Sheet4/M4_C
MON1_4: sheet U_Sec_Controller_Sheet4/MON1_4, sheet U_DIO_4/MON1_4
MON2_4: sheet U_Sec_Controller_Sheet4/MON2_4, sheet U_DIO_4/MON2_4
nFAULT_D: sheet U_Motor_Driver_Sheet4/nFAULT_D, sheet U_Sec_Controller_Sheet4/nFAULT_D
nSCS_D: sheet U_Motor_Driver_Sheet4/nSCS_D, sheet U_Sec_Controller_Sheet4/nSCS_D
RE/DE/ENCD_4: sheet U_Sec_Controller_Sheet4/RE/DE/ENCD_4, sheet U_Encoder_Sheet4/RE/DE/ENCD_4
RXD-ENCD_4: sheet U_Sec_Controller_Sheet4/RXD-ENCD_4, sheet U_Encoder_Sheet4/RXD-ENCD_4
SDI_D: sheet U_Motor_Driver_Sheet4/SDI_D, sheet U_Sec_Controller_Sheet4/SDI_D
SDO_D: sheet U_Motor_Driver_Sheet4/SDO_D, sheet U_Sec_Controller_Sheet4/SDO_D
SIG_7: sheet U_Sec_Controller_Sheet4/SIG_7, sheet U_DIO_4/SIG_7
SIG_8: sheet U_Sec_Controller_Sheet4/SIG_8, sheet U_DIO_4/SIG_8
SOA_D: sheet U_Motor_Driver_Sheet4/SOA_D, sheet U_Sec_Controller_Sheet4/SOA_D
SOB_D: sheet U_Motor_Driver_Sheet4/SOB_D, sheet U_Sec_Controller_Sheet4/SOB_D
SOC_D: sheet U_Motor_Driver_Sheet4/SOC_D, sheet U_Sec_Controller_Sheet4/SOC_D
SWO/SCK_D: sheet U_Motor_Driver_Sheet4/SWO/SCK_D, sheet U_Sec_Controller_Sheet4/SWO/SCK_D
TXD-ENCD_4: sheet U_Sec_Controller_Sheet4/TXD-ENCD_4, sheet U_Encoder_Sheet4/TXD-ENCD_4
USART4_RX: port USART4_RX, sheet U_Sec_Controller_Sheet4/USART4_RX
USART4_TX: port USART4_TX, sheet U_Sec_Controller_Sheet4/USART4_TX

### Buses and harness runs
harness sheet U_DIO_4/DIGITAL4 = sheet U_Sec_Controller_Sheet4/DIGITAL4
harness sheet U_MOSFET_Driver_Sheet4/MOTOR4_CONN = sheet U_Motor_Driver_Sheet4/MOTOR4_CONN

### Notes on the sheet
- File:
- Title:
- Date:
- Page
- Num:
- Total:
- Drawn By: Huzaifa Ali

## Sheet MOSFET_Driver_Sheet4.SchDoc
size 420 x 297 mm; SheetNumber: 30; SheetTotal: 32
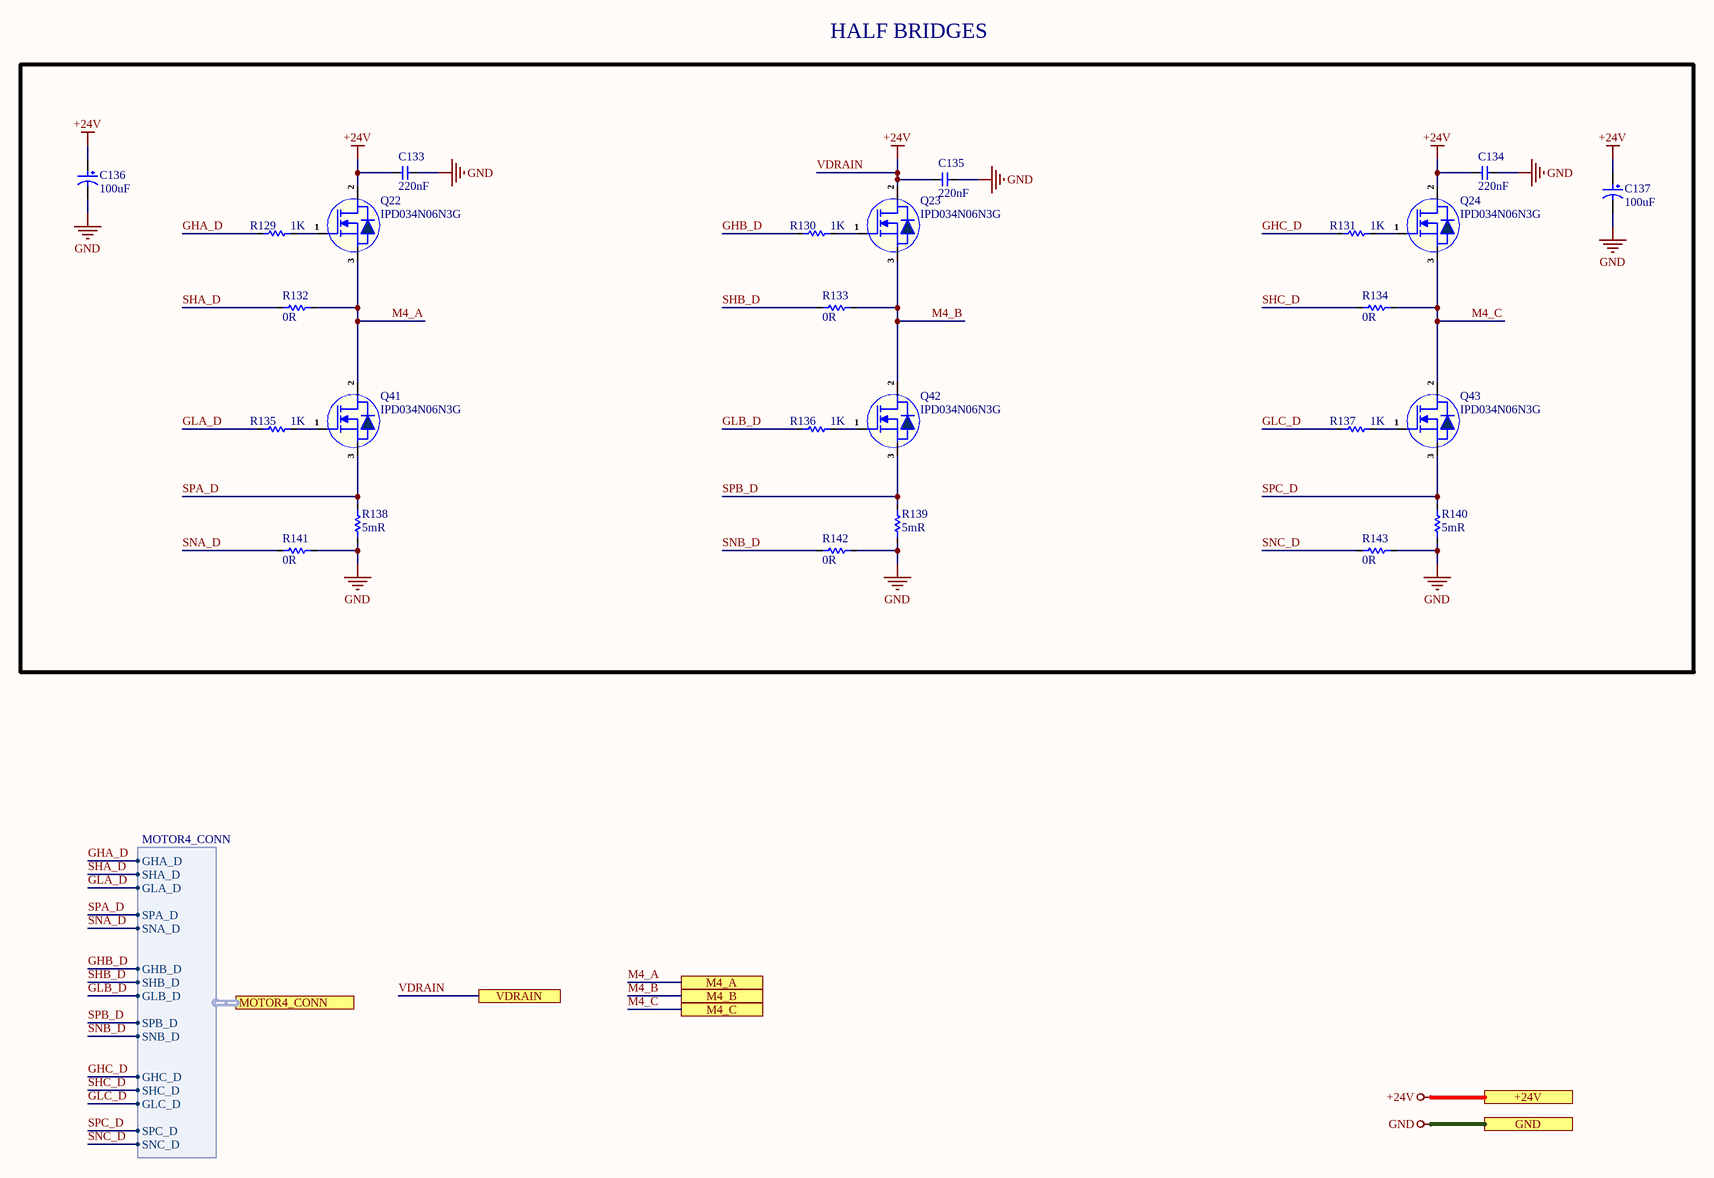
[diagram p27: MOSFET_Driver_Sheet4.SchDoc]

### Parts
C133  220nF  [Cap-0805]
C134  220nF  [Cap-0805]
C135  220nF  [Cap-0805]
C136  100uF  [RVT1A101M0605]
C137  100uF  [RVT1A101M0605]
Q22  IPD034N06N3G  [TO-252-2L]
Q23  IPD034N06N3G  [TO-252-2L]
Q24  IPD034N06N3G  [TO-252-2L]
Q41  IPD034N06N3G  [TO-252-2L]
Q42  IPD034N06N3G  [TO-252-2L]
Q43  IPD034N06N3G  [TO-252-2L]
R129  1K  [Res-0402]
R130  1K  [Res-0402]
R131  1K  [Res-0402]
R132  0R  [Res-0603]
R133  0R  [Res-0603]
R134  0R  [Res-0603]
R135  1K  [Res-0402]
R136  1K  [Res-0402]
R137  1K  [Res-0402]
R138  5mR  [Res-1206]
R139  5mR  [Res-1206]
R140  5mR  [Res-1206]
R141  0R  [Res-0603]
R142  0R  [Res-0603]
R143  0R  [Res-0603]

### Ports
+24V (see Servo4[4A], Connector_Sheet[5D], DIO_1[5D], DIO_2[5D], DIO_3[5D], DIO_4[5D], MOSFET_Driver_Sheet1[5D], MOSFET_Driver_Sheet2[5D], MOSFET_Driver_Sheet3[5D], Motor_Driver_Sheet1[5D], Motor_Driver_Sheet2[5D], Motor_Driver_Sheet3[5D], Motor_Driver_Sheet4[5D], Power_Sheet[5D]), GND (see Servo4[4B], CAN_Sheet[5D], Connector_Sheet[5D], Controller_Sheet[5D], DIO_1[5D], DIO_2[5D], DIO_3[5D], DIO_4[5D], Encoder_Sheet1[5D], Encoder_Sheet2[5D], Encoder_Sheet3[5D], Encoder_Sheet4[5D], EtherCAT_Sheet[5D], MOSFET_Driver_Sheet1[5D], MOSFET_Driver_Sheet2[5D], MOSFET_Driver_Sheet3[5D], Motor_Driver_Sheet1[5D], Motor_Driver_Sheet2[5D], Motor_Driver_Sheet3[5D], Motor_Driver_Sheet4[5D], Power_Sheet[5D], RJ45_Sheet[5D], RS485_RS232_Sheet[3D], Sec_Controller_Sheet1[5D], Sec_Controller_Sheet2[5D], Sec_Controller_Sheet3[5D], Sec_Controller_Sheet4[5D]), M4_A (see Servo4[5B], Connector_Sheet[4D], Servo4[5B]), M4_B (see Servo4[5B], Connector_Sheet[4D], Servo4[5B]), M4_C (see Servo4[5B], Connector_Sheet[4D], Servo4[5B]), MOTOR4_CONN (harness MOTOR4_CONN, see Servo4[4B], Motor_Driver_Sheet4[2D]), VDRAIN (see Servo4[4B], MOSFET_Driver_Sheet1[2D], MOSFET_Driver_Sheet2[2D], MOSFET_Driver_Sheet3[2D], Motor_Driver_Sheet1[2D], Motor_Driver_Sheet2[2D], Motor_Driver_Sheet3[2D], Motor_Driver_Sheet4[2D])

### Harnesses
MOTOR4_CONN: GHA_D, SHA_D, GLA_D, SPA_D, SNA_D, GHB_D, SHB_D, GLB_D, SPB_D, SNB_D, GHC_D, SHC_D, GLC_D, SPC_D, SNC_D

### Nets
GND: C133.1 C134.1 C135.1 C136.2 C137.2 R138.1 R139.1 R140.1 R141.1 R142.1 R143.1 ; port GND
VDRAIN: C133.2 C134.2 C135.2 C136.1 C137.1 Q22.2(D) Q23.2(D) Q24.2(D) ; port +24V, port VDRAIN  [also labelled +24V]
GHA_D: R129.1 ; port MOTOR4_CONN.GHA_D
GHB_D: R130.1 ; port MOTOR4_CONN.GHB_D
GHC_D: R131.1 ; port MOTOR4_CONN.GHC_D
GLA_D: R135.1 ; port MOTOR4_CONN.GLA_D
GLB_D: R136.1 ; port MOTOR4_CONN.GLB_D
GLC_D: R137.1 ; port MOTOR4_CONN.GLC_D
M4_A: Q22.3(S) Q41.2(D) R132.1 ; port M4_A
M4_B: Q23.3(S) Q42.2(D) R133.1 ; port M4_B
M4_C: Q24.3(S) Q43.2(D) R134.1 ; port M4_C
SHA_D: R132.2 ; port MOTOR4_CONN.SHA_D
SHB_D: R133.2 ; port MOTOR4_CONN.SHB_D
SHC_D: R134.2 ; port MOTOR4_CONN.SHC_D
SNA_D: R141.2 ; port MOTOR4_CONN.SNA_D
SNB_D: R142.2 ; port MOTOR4_CONN.SNB_D
SNC_D: R143.2 ; port MOTOR4_CONN.SNC_D
SPA_D: Q41.3(S) R138.2 ; port MOTOR4_CONN.SPA_D
SPB_D: Q42.3(S) R139.2 ; port MOTOR4_CONN.SPB_D
SPC_D: Q43.3(S) R140.2 ; port MOTOR4_CONN.SPC_D
NetQ22_1: Q22.1(G) R129.2
NetQ23_1: Q23.1(G) R130.2
NetQ24_1: Q24.1(G) R131.2
NetQ41_1: Q41.1(G) R135.2
NetQ42_1: Q42.1(G) R136.2
NetQ43_1: Q43.1(G) R137.2

### Notes on the sheet
- HALF BRIDGES
- File:
- Title:
- Date:
- Page
- Num:
- Total:
- Drawn By: Huzaifa Ali

### Library data of the parts
C133-C135 = 08051C224K4T2A: CAP CER 0.22UF 100V X7R 0805; Manufacturer: Kyocera AVX; Tolerance: 10%; Item Type: Capacitor; Supplier 1: Digi-Key; Manufacturer Part Number: 08051C224K4T2A; RoHS: Yes; Category: Ceramic Capacitors; Stock 1: 151; Pricing 1: 1=0.27000, 10=0.18500, 50=0.12320, 100=0.10470, 500=0.07392, 1000=0.06468 (USD); Mount: Surface Mount; Case/Package: 0805; Contact Plating: Tin; Min Operating Temperature: -55°C; Max Operating Temperature: 125°C; Termination: Wraparound; Capacitance: 220nF; Dielectric: X7R; Voltage Rating (DC): 100V; Length: 2.01mm; RoHS Compliant: Yes; ComponentLink1URL: http://datasheets.avx.com/AutoMLCC.pdf?src-supplier=Avnet+Asia; ComponentLink1Description: http://datasheets.avx.com/AutoMLCC.pdf?src-supplier=Avnet+Asia; Supplier Part Number 1: 478-13049-1-ND; LCSC Part Number: C2176107
C136 C137 = RVT1A101M0605: 100uF 10V 55mA@120Hz ±20% SMD,D6.3xL5.4mm Aluminum Electrolytic Capacitors - SMD ROHS; Manufacturer: ROQANG; Manufacturer Part Number: RVT1A101M0605; Package: SMD,D6.3xL5.4mm; LCSC Part Number: C72474; Item Type: Capacitor; ComponentLink1Description: LCSC; ComponentLink1URL: https://www.lcsc.com/product-detail/Aluminum-Electrolytic-Capacitors-SMD_ROQANG-RVT1A101M0605_C72474.html
Q22-Q24 Q41-Q43 = IPD034N06N3G: MOSFET N-CH 60V 100A TO252-3; Manufacturer: Infineon; Supplier: Mouser; Supplier Part Number: 726-IPD034N06N3G; Manufacturer Part Number: IPD034N06N3G; RoHS: Yes; Stock: 7587; Pricing: 1=1.76, 10=1.48, 50=1.48, 100=1.2, 1000=0.837, 10000=0.747 (USD); LCSC Part Number: C94897; Item Type: Mosfet
R129-R131 R135-R137 = RC0402FR-071KL: as R192 on sheet Encoder_Sheet3; Supplier 1: Avnet; Manufacturer Part Number: RC0402FR-071KL; RoHS: Yes; Category: Chip SMD Resistors; Stock 1: 13030000; Pricing 1: 10000=0.00085, 20000=0.00087, 40000=0.00084, 60000=0.00083, 80000=0.00079, 100000=0.00078, 1000000=0.00076 (USD); Case/Package: 0402; Number of Pins: 2; Case Code (Imperial): 0402; Case Code (Metric): 1005; Size Code: 0402; Min Operating Temperature: -55°C; Max Operating Temperature: 155°C; Resistor Type: Thick Film; Tolerance: 1%; Packaging: Tape and Reel; Voltage Rating: 50V; Termination: SMD/SMT; Features: Moisture Resistant; Series: RC; Number of Terminations: 2; Resistance Tolerance: 1%; Construction: Rectangular; Technology: THICK FILM; Length: 1mm; Width: 0.5mm; Height: 0.32mm; Depth: 0.5mm; Reach SVHC Compliant: Yes; Lead Free: Lead Free; RoHS Compliant: Yes; Military Standard: Not; ComponentLink1URL: https://datasheet.ciiva.com/11819/0900766b80c66297-11819477.pdf?src-supplier=RSComponents; ComponentLink1Description: https://datasheet.ciiva.com/11819/0900766b80c66297-11819477.pdf?src-supplier=RSComponents; ComponentLink2URL: https://datasheet.ciiva.com/7983/1018594-7983502.pdf?src-supplier=Element14; ComponentLink2Description: https://datasheet.ciiva.com/7983/1018594-7983502.pdf?src-supplier=Element14; ComponentLink3URL: https://datasheet.ciiva.com/22747/1018594-22747513.pdf?src-supplier=Element14; ComponentLink3Description: https://datasheet.ciiva.com/22747/1018594-22747513.pdf?src-supplier=Element14; ComponentLink4URL: https://datasheet.ciiva.com/12666/pyu-rc0402-51-rohs-l-6-r-12666741.pdf?src-supplier=Mouser; ComponentLink4Description: https://datasheet.ciiva.com/12666/pyu-rc0402-51-rohs-l-6-r-12666741.pdf?src-supplier=Mouser; ComponentLink5URL: https://datasheet.ciiva.com/7849/1018594-7849869.pdf?src-supplier=Element14; ComponentLink5Description: https://datasheet.ciiva.com/7849/1018594-7849869.pdf?src-supplier=Element14; ComponentLink6URL: https://datasheet.ciiva.com/7849/1018594-7849871.pdf?src-supplier=Element14; ComponentLink6Description: https://datasheet.ciiva.com/7849/1018594-7849871.pdf?src-supplier=Element14; ComponentLink7URL: https://datasheet.ciiva.com/17063/pyu-rc0402-51-rohs-l-6-r-17063193.pdf?src-supplier=Future+Electronics; ComponentLink7Description: https://datasheet.ciiva.com/17063/pyu-rc0402-51-rohs-l-6-r-17063193.pdf?src-supplier=Future+Electronics; Supplier Part Number 1: RC0402FR-071KL; LCSC Part Number: C106235
R132-R134 R141-R143 = RC0603JR-070RL: as R61-R63 on sheet Sec_Controller_Sheet3; Supplier 1: Digi-Key; Manufacturer Part Number: RC0603JR-070RL; RoHS: Yes; Category: Chip SMD Resistors; Stock 1: 18081776; Pricing 1: 1=0.10000, 10=0.01700, 25=0.01240, 50=0.00960, 100=0.00700, 250=0.00536, 500=0.00430, 1000=0.00316 (USD); Case/Package: 0603; Number of Pins: 2; Contact Plating: Tin,Matte; Case Code (Imperial): 0603; Case Code (Metric): 1608; Size Code: 0603; Min Operating Temperature: -55°C; Max Operating Temperature: 155°C; Resistor Type: Thick Film; Packaging: Tape and Reel; Termination: SMD/SMT; Series: RC; Technology: THICK FILM; Package Quantity: 5000; Voltage Rating: 50V; Features: Moisture Resistant; Max Power Dissipation: 100mW; Number of Terminations: 2; Construction: Rectangular; Length: 1.6mm; Width: 0.8mm; Height: 0.45mm; Depth: 0.8mm; Radiation Hardening: No; Reach SVHC Compliant: No SVHC; Lead Free: Lead Free; RoHS Compliant: Yes; Military Standard: Not; Supplier Part Number 1: 311-0.0GRCT-ND; LCSC Part Number: C95177
R138-R140 = CUM1206-15FR005: 1W 5mΩ ±1% 1206 Current Sense Resistors/Shunt Resistors ROHS; Manufacturer: FORT; Item Type: Capacitor; Manufacturer Part Number: CUM1206-15FR005; Package: 1206; LCSC Part Number: C5185588; ComponentLink1Description: LCSC; ComponentLink1URL: https://www.lcsc.com/product-detail/Current-Sense-Resistors-Shunt-Resistors_FORT-CUM1206-15FR005_C5185588.html